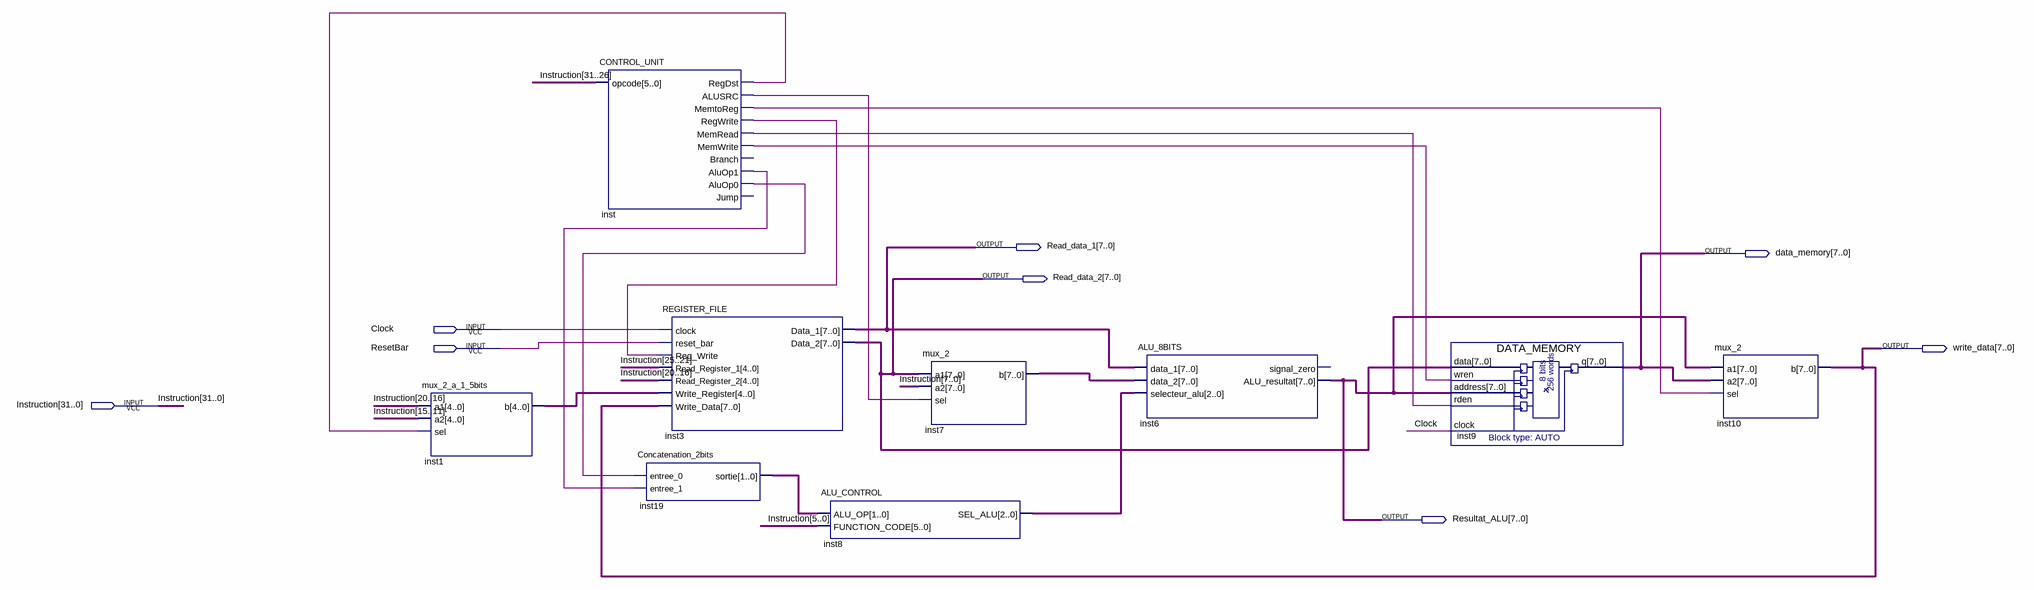
[diagram p0: schematic sheet]
// Quartus schematic Diagram_test_sans_PC.bdf as structural Verilog: 9 symbols, 8 pins
module Diagram_test_sans_PC (
  input  Clock,
  input  ResetBar,
  input  [31:0] Instruction,
  output [7:0] Read_data_1,
  output [7:0] data_memory,
  output [7:0] Read_data_2,
  output [7:0] write_data,
  output [7:0] Resultat_ALU
);

  wire inst_aluop0, inst_aluop1, inst_alusrc, inst_memread, inst_memtoreg, inst_memwrite, inst_regdst,
       inst_regwrite;
  wire [1:0] inst19_sortie;
  wire [2:0] inst8_sel_alu;
  wire [4:0] inst1_b;
  wire [7:0] inst7_b;

  mux_2_a_1_5bits inst1 (.a1(Instruction[20:16]), .a2(Instruction[15:11]), .sel(inst_regdst), .b(inst1_b));
  CONTROL_UNIT inst (
    .opcode(Instruction[31:26]), .RegDst(inst_regdst), .ALUSRC(inst_alusrc), .MemtoReg(inst_memtoreg),
    .RegWrite(inst_regwrite), .MemRead(inst_memread), .MemWrite(inst_memwrite), .AluOp1(inst_aluop1),
    .AluOp0(inst_aluop0));  // open: Branch, Jump
  REGISTER_FILE inst3 (
    .clock(Clock), .reset_bar(ResetBar), .Reg_Write(inst_regwrite), .Read_Register_1(Instruction[25:21]),
    .Read_Register_2(Instruction[20:16]), .Write_Register(inst1_b), .Write_Data(write_data),
    .Data_1(Read_data_1), .Data_2(Read_data_2));
  Concatenation_2bits inst19 (.entree_0(inst_aluop0), .entree_1(inst_aluop1), .sortie(inst19_sortie));
  ALU_CONTROL inst8 (.ALU_OP(inst19_sortie), .FUNCTION_CODE(Instruction[5:0]), .SEL_ALU(inst8_sel_alu));
  mux_2 inst7 (.a1(Read_data_2), .a2(Instruction[7:0]), .sel(inst_alusrc), .b(inst7_b));
  ALU_8BITS inst6 (
    .data_1(Read_data_1), .data_2(inst7_b), .selecteur_alu(inst8_sel_alu), .ALU_resultat(Resultat_ALU));  // open: signal_zero
  DATA_MEMORY inst9 (
    .data(Read_data_2), .wren(inst_memwrite), .address(Resultat_ALU), .rden(inst_memread), .clock(Clock),
    .q(data_memory));
  mux_2 inst10 (.a1(Resultat_ALU), .a2(data_memory), .sel(inst_memtoreg), .b(write_data));
endmodule
